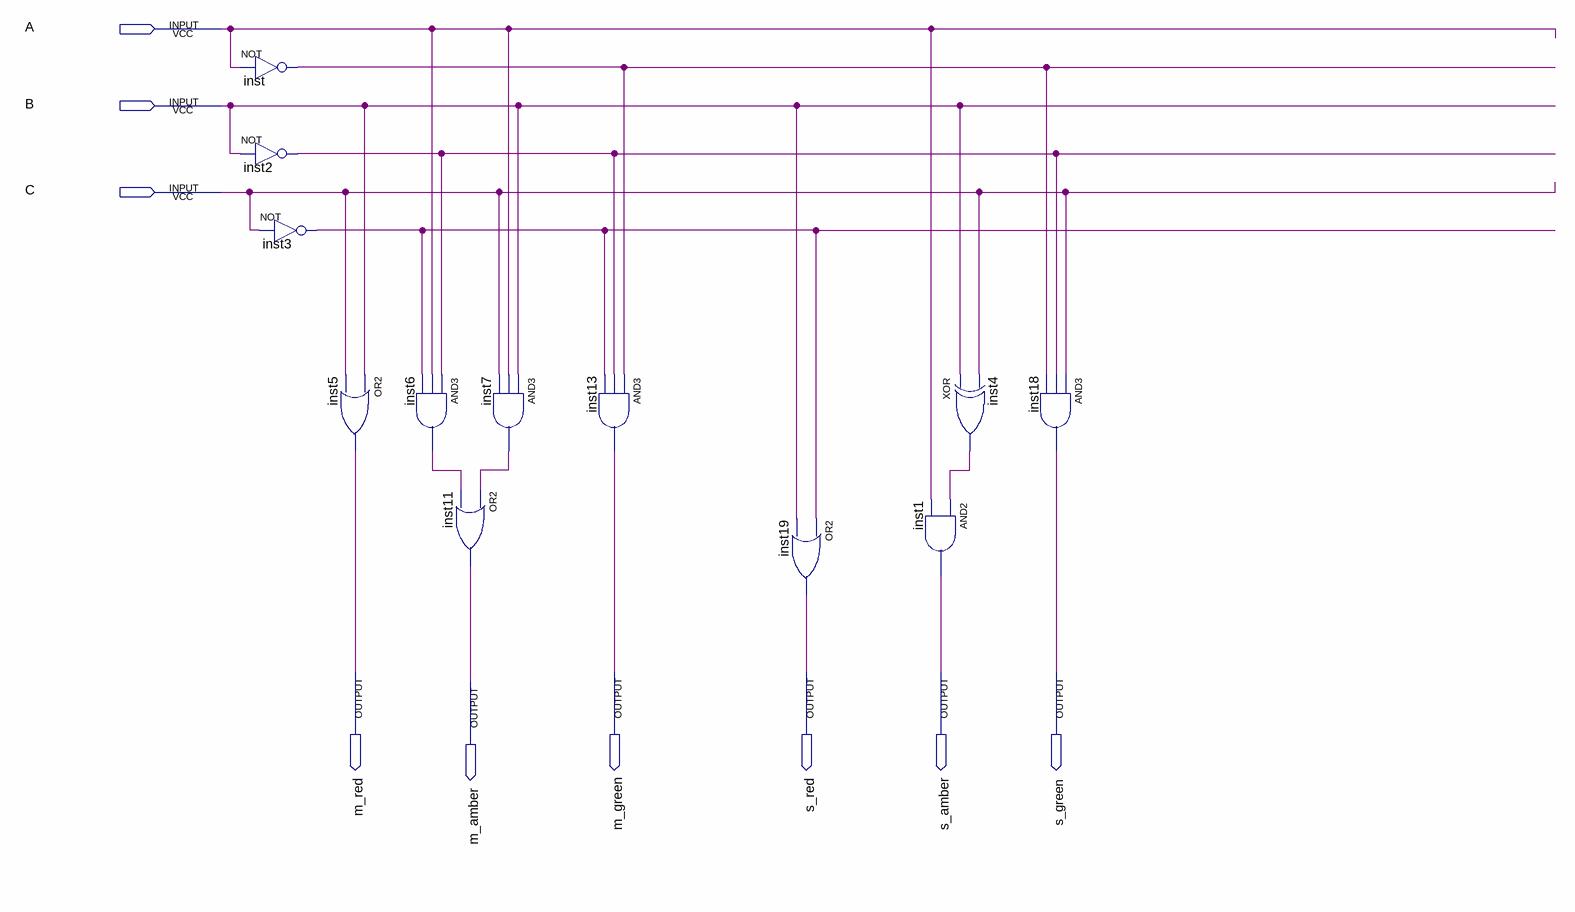
[diagram p0: schematic sheet]
// Quartus schematic lightdecoder.bdf as structural Verilog: 12 symbols, 9 pins
module lightdecoder (
  input  A,
  input  B,
  input  C,
  output m_red,
  output m_green,
  output s_red,
  output s_amber,
  output s_green,
  output m_amber
);

  wire inst2_out, inst3_out, inst4_out, inst6_out, inst7_out, inst_out;

  not inst (inst_out, A);
  not inst2 (inst2_out, B);
  not inst3 (inst3_out, C);
  or inst5 (m_red, B, C);
  and inst6 (inst6_out, inst2_out, A, inst3_out);
  and inst7 (inst7_out, B, A, C);
  or inst11 (m_amber, inst7_out, inst6_out);
  and inst13 (m_green, inst_out, inst2_out, inst3_out);
  or inst19 (s_red, inst3_out, B);
  xor inst4 (inst4_out, B, C);
  and inst1 (s_amber, inst4_out, A);
  and inst18 (s_green, C, inst2_out, inst_out);
endmodule
